# EAGLE design clippy-0.5 (EAGLE 7.2.0)
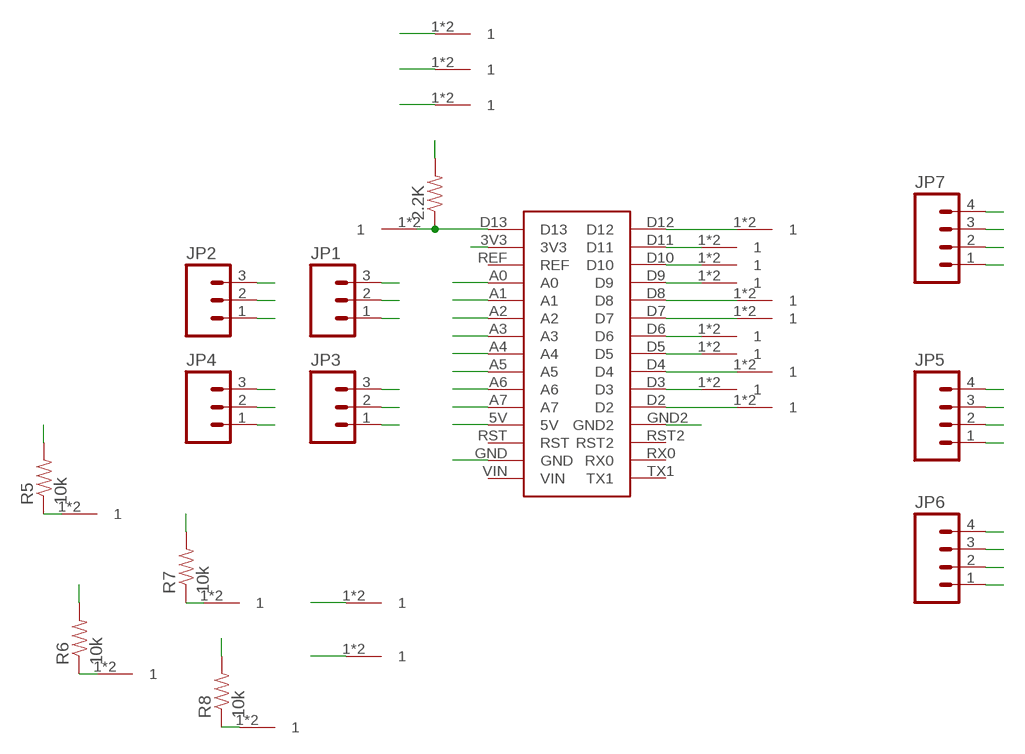
[diagram p0: schematic, sheet 1]

## Parts
2.2K  RESISTORPTH-1/4W  [AXIAL-0.4]
JP1  M031X03_NO_SILK  [1X03_NO_SILK]
JP2  M031X03_NO_SILK  [1X03_NO_SILK]
JP3  M031X03_NO_SILK  [1X03_NO_SILK]
JP4  M031X03_NO_SILK  [1X03_NO_SILK]
JP5  M04PTH  [1X04]
JP6  M04PTH  [1X04]
JP7  M04PTH  [1X04]
R5  10k  RESISTORPTH-1/6W  [1/6W-RES]
R6  10k  RESISTORPTH-1/6W  [1/6W-RES]
R7  10k  RESISTORPTH-1/6W  [1/6W-RES]
R8  10k  RESISTORPTH-1/6W  [1/6W-RES]
U$1  NANO  [MYCON2_HEAD15-NOSS]
U$2  CLIPPY  [CLIPPY]
U$3  CLIPPY  [CLIPPY]
U$4  CLIPPY  [CLIPPY]
U$5  CLIPPY  [CLIPPY]
U$6  CLIPPY  [CLIPPY]
U$7  CLIPPY  [CLIPPY]
U$8  CLIPPY  [CLIPPY]
U$9  CLIPPY  [CLIPPY]
U$10  CLIPPY  [CLIPPY]
U$11  CLIPPY  [CLIPPY]
U$12  CLIPPY  [CLIPPY]
U$13  CLIPPY  [CLIPPY]
U$14  CLIPPY  [CLIPPY]
U$15  CLIPPY  [CLIPPY]
U$16  CLIPPY  [CLIPPY]
U$17  CLIPPY  [CLIPPY]
U$18  CLIPPY  [CLIPPY]
U$19  CLIPPY  [CLIPPY]
U$20  CLIPPY  [CLIPPY]
U$21  CLIPPY  [CLIPPY]
U$22  CLIPPY  [CLIPPY]

## Nets
3.3V: JP7.1 JP7.2 JP7.3 JP7.4 U$1.3V3
5V: 2.2K.P$2 JP1.3 JP2.3 JP3.3 JP4.3 JP5.1 JP5.2 JP5.3 JP5.4 R5.2 R6.2 R7.2 R8.2 U$1.5V
A0: JP1.2 U$1.A0
A1: JP2.2 U$1.A1
A2: JP3.2 U$1.A2
A3: JP4.2 U$1.A3
A4: R5.1 U$1.A4 U$7.1 U$7.2
A5: R7.1 U$1.A5 U$17.1 U$17.2
A6: R6.1 U$1.A6 U$18.1 U$18.2
A7: R8.1 U$1.A7 U$19.1 U$19.2
D2: U$1.D2 U$2.1 U$2.2
D3: U$1.D3 U$3.1 U$3.2
D4: U$1.D4 U$4.1 U$4.2
D5: U$1.D5 U$5.1 U$5.2
D6: U$1.D6 U$6.1 U$6.2
D7: U$1.D7 U$10.1 U$10.2
D8: U$1.D8 U$11.1 U$11.2
D9: U$1.D9 U$12.1 U$12.2
D10: U$1.D10 U$13.1 U$13.2
D11: U$1.D11 U$14.1 U$14.2
D12: U$1.D12 U$15.1 U$15.2
D13: 2.2K.P$1 U$1.D13 U$16.1 U$16.2
GND: JP1.1 JP2.1 JP3.1 JP4.1 JP6.1 JP6.2 JP6.3 JP6.4 U$1.GND U$1.GND2 U$8.1 U$8.2 U$9.1 U$9.2 U$20.1 U$20.2 U$21.1 U$21.2 U$22.1 U$22.2
Unconnected: U$1.REF U$1.RST U$1.RST2 U$1.RX0 U$1.TX1 U$1.VIN

## Library data of the parts
2.2K R5-R8 = SparkFun-Passives:RESISTOR: Resistor Basic schematic elements and footprints for 0603, 1206, and PTH resistors.
JP1-JP4 = SparkFun-Connectors:M03: Header 3 Standard 3-pin 0.1" header. Use with straight break away headers (SKU : PRT-00116), right angle break away headers (PRT-00553), swiss pins (PRT-00743), machine pins (PRT-00117), and female headers (PRT-00115). Molex polarized connector foot print use with SKU : PRT-08232 with associated crimp pins and housings.
JP5-JP7 = SparkFun-Connectors:M04: Header 4 Standard 4-pin 0.1" header. Use with straight break away headers (SKU : PRT-00116), right angle break away headers (PRT-00553), swiss pins (PRT-00743), machine pins (PRT-00117), and female headers (PRT-00115). Molex polarized connector foot print use with SKU : PRT-08231 with associated crimp pins and housings. 1MM SMD Version SKU: PRT-10208
U$1 = jif:NANO
U$2-U$22 = jif:CLIPPY

## Board
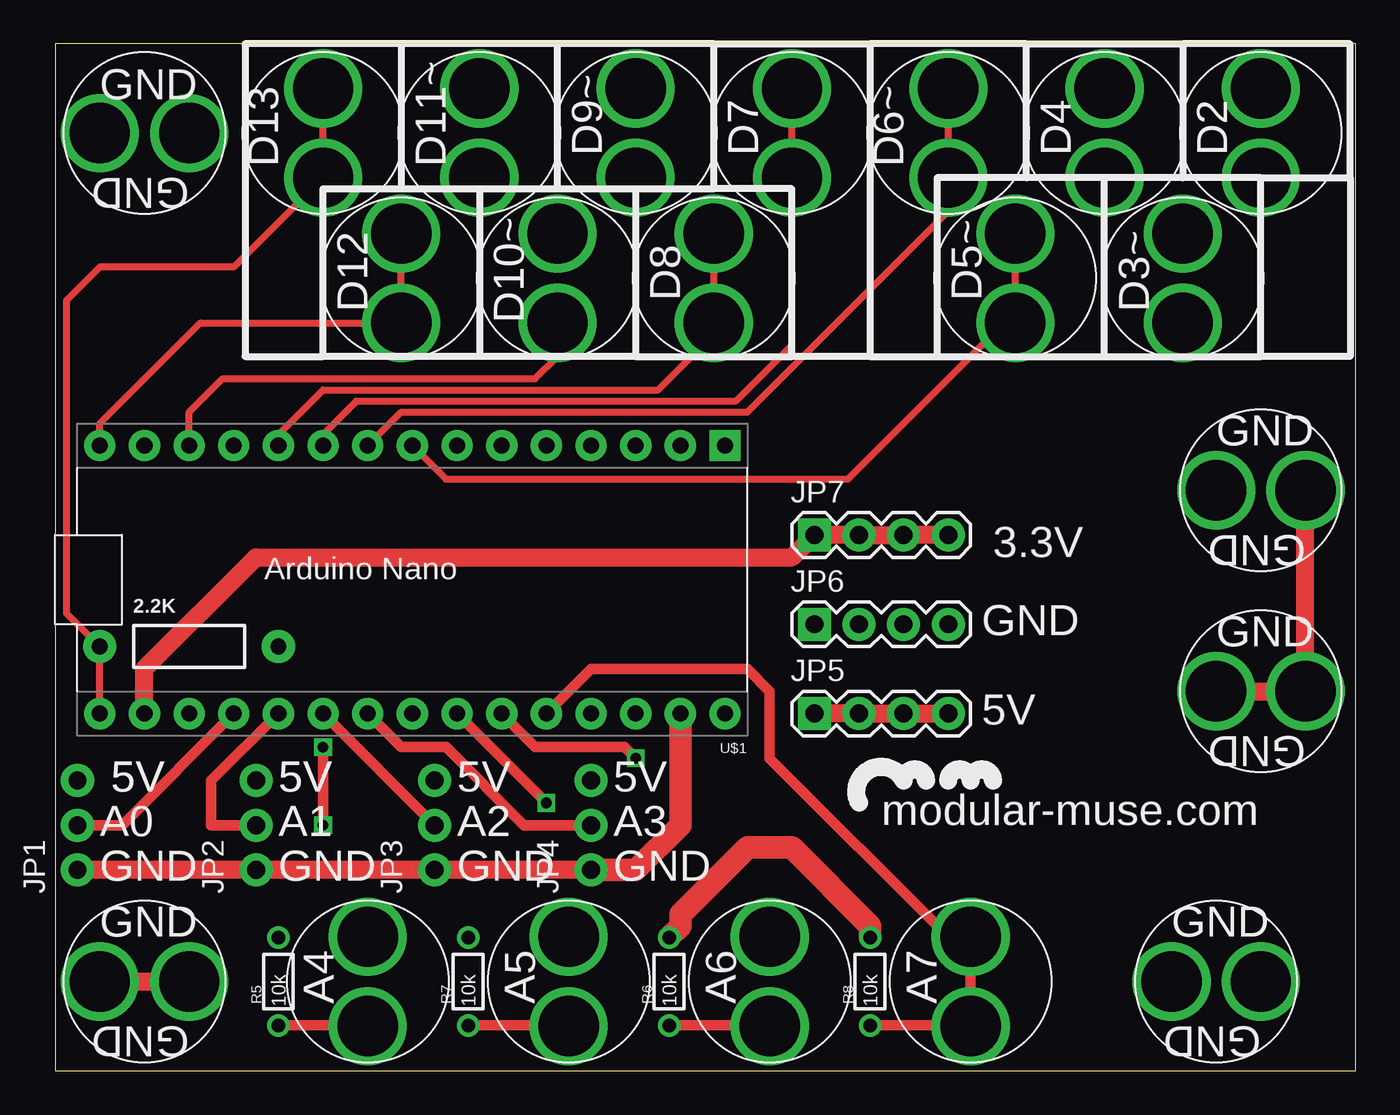
[diagram p1: board, top side]
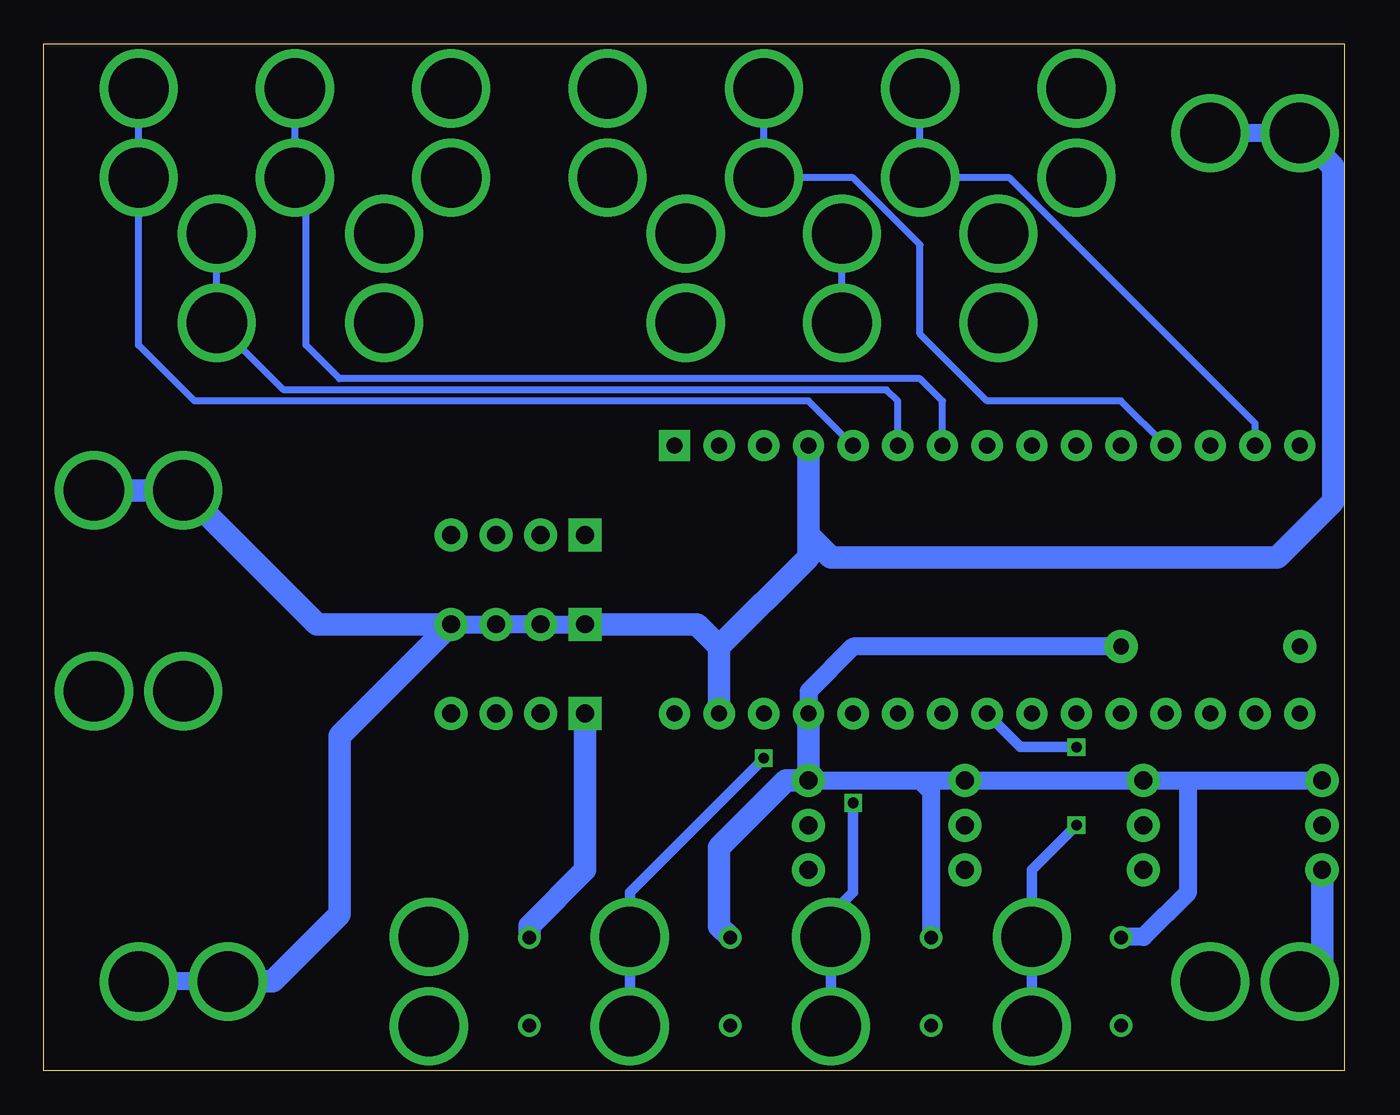
[diagram p2: board, bottom side, seen from below]

Size 73.96 x 58.41 mm. Coordinates in mm from the lower left corner, seen from the top.
Outline: 0,0 73.96,0 73.96,58.41 0,58.41 0,0
Copper layers (1*16): Top 0.035mm / dielectric 1.5mm / Bottom 0.035mm
Design rules "default": minimum track width 10mil, minimum drill 24mil, track to track 8mil, track to pad 8mil, pad to pad 8mil, via to via 8mil, smd to smd 8mil, copper to edge 40mil, drill to drill 8mil, minimum pad ring 10mil, minimum via ring 8mil, stop-mask expansion 4mil, vias tented up to drill 0mil, thermal gap 10mil

### Footprints (pad centres in the part's own frame; a part is rotated, then mirrored left to right if it is on the bottom)
AXIAL-0.4 = drill 0.9 pad 1.88: P$1 -5.08,0; P$2 5.08,0
1X03_NO_SILK = drill 1.016 pad 1.88: 1 0,0; 2 2.54,0; 3 5.08,0
1X04 = drill 1.016 pad 1.88 square: 1 0,0 | drill 1.016 pad 1.88: 2 2.54,0; 3 5.08,0; 4 7.62,0
1/6W-RES = drill 0.762: 1 -2.5,0; 2 2.5,0
MYCON2_HEAD15-NOSS = drill 0.914 pad 1.778: 3V3 33.02,0; 5V 7.62,0; A0 27.94,0; A1 25.4,0; A2 22.86,0; A3 20.32,0; A4 17.78,0; A5 15.24,0; A6 12.7,0; A7 10.16,0; D2 10.16,-15.24; D3 12.7,-15.24; D4 15.24,-15.24; D5 17.78,-15.24; D6 20.32,-15.24; D7 22.86,-15.24; D8 25.4,-15.24; D9 27.94,-15.24; D10 30.48,-15.24; D11 33.02,-15.24; D12 35.56,-15.24; D13 35.56,0; GND 2.54,0; GND2 7.62,-15.24; REF 30.48,0; RST 5.08,0; RST2 5.08,-15.24; RX0 2.54,-15.24; VIN 0,0 | drill 0.914 pad 1.778 square: TX1 0,-15.24
CLIPPY = drill 3.429: 1 0,0; 2 5.08,0

### Placement (x,y rotation side)
2.2K  7.62,24.13 0 top
JP1  1.27,11.43 90 top
JP2  11.43,11.43 90 top
JP3  21.59,11.43 90 top
JP4  30.48,11.43 90 top
JP5  43.18,20.32 0 top
JP6  43.18,25.4 0 top
JP7  43.18,30.48 0 top
R5  12.7,5.08 90 top
R6  34.93,5.08 90 top
R7  23.5,5.08 90 top
R8  46.36,5.08 90 top
U$1  38.1,20.32 180 top
U$2  68.58,55.88 270 top
U$3  64.14,47.62 270 top
U$4  59.69,55.88 270 top
U$5  54.61,47.62 270 top
U$6  50.8,55.88 270 top
U$7  17.78,2.54 90 top
U$8  66.04,33.02 0 top
U$9  2.54,53.34 0 top
U$10  41.91,55.88 270 top
U$11  37.47,47.62 270 top
U$12  33.02,55.88 270 top
U$13  28.57,47.62 270 top
U$14  24.13,55.88 270 top
U$15  19.68,47.62 270 top
U$16  15.24,55.88 270 top
U$17  29.21,2.54 90 top
U$18  40.64,2.54 90 top
U$19  52.07,2.54 90 top
U$20  63.5,5.08 0 top
U$21  2.54,5.08 0 top
U$22  66.04,21.59 0 top

### Tracks (layer width: path | path; a pad name or v marks a point on that pad's centre or on a via)
3.3V
  Top 1.016: U$1.3V3 5.08,22.86 11.43,29.21 41.91,29.21 JP7.1 JP7.2 JP7.3 JP7.4
5V
  Top 1.016: JP5.4 JP5.3 JP5.2 JP5.1
  Top 1.27: R8.2 46.36,8.25 41.91,12.7 39.37,12.7 35.56,8.89 35.56,8.21 R6.2
  Bottom 1.016: JP4.3 24.13,16.51 | 24.13,16.51 JP3.3 JP2.3 8.89,16.51 | 8.89,16.51 JP1.3 | 8.89,16.51 8.89,10.16 11.43,7.62 12.66,7.62 R5.2 | 24.13,16.51 23.5,15.87 R7.2 | 2.2K.P$2 27.94,24.13 30.48,21.59 U$1.5V
  Bottom 1.27: U$1.5V JP4.3 31.75,16.51 35.56,12.7 35.56,8.21 R6.2 | JP5.1 43.18,11.43 46.36,8.25 R8.2
A0
  Top 0.61: U$1.A0 3.81,13.97 JP1.2
A1
  Top 0.61: U$1.A1 8.89,16.51 8.89,13.97 JP2.2
A2
  Top 0.61: U$1.A2 JP3.2
A3
  Top 0.61: U$1.A3 19.68,18.41 22.22,18.41 26.67,13.97 JP4.2
A4  (via drill 0.6)
  Top 0.61: v15.24,18.41 v15.24,13.97 | R5.1 17.74,2.58 U$7.1
  Bottom 0.61: U$7.1 U$7.2 17.78,11.43 v15.24,13.97 | v15.24,18.41 18.41,18.41 U$1.A4
A5  (via drill 0.6)
  Top 0.61: U$1.A5 v27.94,15.24 | R7.1 29.17,2.58 U$17.1
  Bottom 0.61: U$17.1 U$17.2 29.21,8.89 27.94,10.16 v27.94,15.24
A6  (via drill 0.6)
  Top 0.61: U$1.A6 27.3,18.41 32.38,18.41 v33.02,17.78 | R6.1 40.6,2.58 U$18.1
  Bottom 0.61: U$18.1 U$18.2 40.64,10.16 v33.02,17.78
A7
  Top 0.61: U$1.A7 30.48,22.86 39.37,22.86 40.64,21.59 40.64,17.78 50.8,7.62 U$19.2 U$19.1 52.03,2.58 R8.1
D2
  Bottom 0.406: U$1.D2 30.48,38.1 65.41,38.1 68.58,41.27 U$2.2 U$2.1
D3
  Bottom 0.406: U$1.D3 25.4,38.1 26.04,38.73 60.33,38.73 U$3.2 U$3.1
D4
  Bottom 0.406: U$1.D4 22.86,38.1 24.13,39.37 57.15,39.37 59.05,41.27 59.05,50.16 U$4.2 U$4.1
D5
  Top 0.406: U$1.D5 22.22,33.66 45.09,33.66 53.34,41.91 53.98,41.91 U$5.2 U$5.1
D6
  Top 0.406: U$6.1 U$6.2 50.8,48.89 39.37,37.47 19.68,37.47 U$1.D6
D7
  Top 0.406: U$10.1 U$10.2 41.91,41.27 38.74,38.1 17.14,38.1 15.24,36.19 U$1.D7
D8
  Top 0.406: U$11.1 U$11.2 37.47,41.91 34.29,38.73 15.24,38.73 12.7,36.19 U$1.D8
D9
  Bottom 0.406: U$12.1 U$12.2 27.94,50.8 24.13,46.99 24.13,41.91 20.32,38.1 12.7,38.1 U$1.D9
D10
  Top 0.406: U$1.D10 7.62,37.47 9.53,39.37 27.3,39.37 28.57,40.64 U$13.2
  Bottom 0.406: U$13.2 U$13.1
D11
  Bottom 0.406: U$1.D11 5.08,36.83 19.05,50.8 U$14.2 U$14.1
D12
  Top 0.406: U$1.D12 2.54,36.83 8.26,42.55 U$15.2 U$15.1
D13
  Top 0.406: U$1.D13 2.2K.P$1 0.64,26.04 0.64,43.81 2.54,45.72 10.16,45.72 U$16.2 U$16.1
GND
  Top 1.016: JP4.1 JP3.1 JP2.1 JP1.1 | U$21.1 U$21.2 | U$22.1 U$22.2 U$8.2
  Top 1.27: U$1.GND 35.56,13.97 33.02,11.43 JP4.1
  Bottom 1.016: U$9.1 U$9.2 | JP6.4 JP6.3 JP6.2 JP6.1 | U$20.1 U$20.2
  Bottom 1.27: U$1.GND 35.56,24.13 | 35.56,24.13 36.83,25.4 JP6.1 | 35.56,24.13 30.48,29.21 U$1.GND2 30.48,30.48 29.21,29.21 3.81,29.21 0.64,32.39 0.64,51.43 U$9.1 | U$20.1 60.96,5.08 57.15,8.89 57.15,19.05 JP6.4 58.42,25.4 U$8.1 U$8.2 | U$21.1 1.27,6.35 JP1.1

### Text on the board
tPlace: GND | D9~ | D7 | D4 | D2 | D13 | D11~ | D6~ | GND | D12 | D8 | D5~ | D3~ | D10~ | GND | GND | GND | 3.3V | GND | GND | 5V | GND | 5V | 5V | 5V | 5V | 5V | 5V | A0 | A1 | A2 | A3 | GND | GND | GND | GND | GND | GND | A4 | A5 | A6 | A7 | GND | GND
_tsilk: modular-muse.com